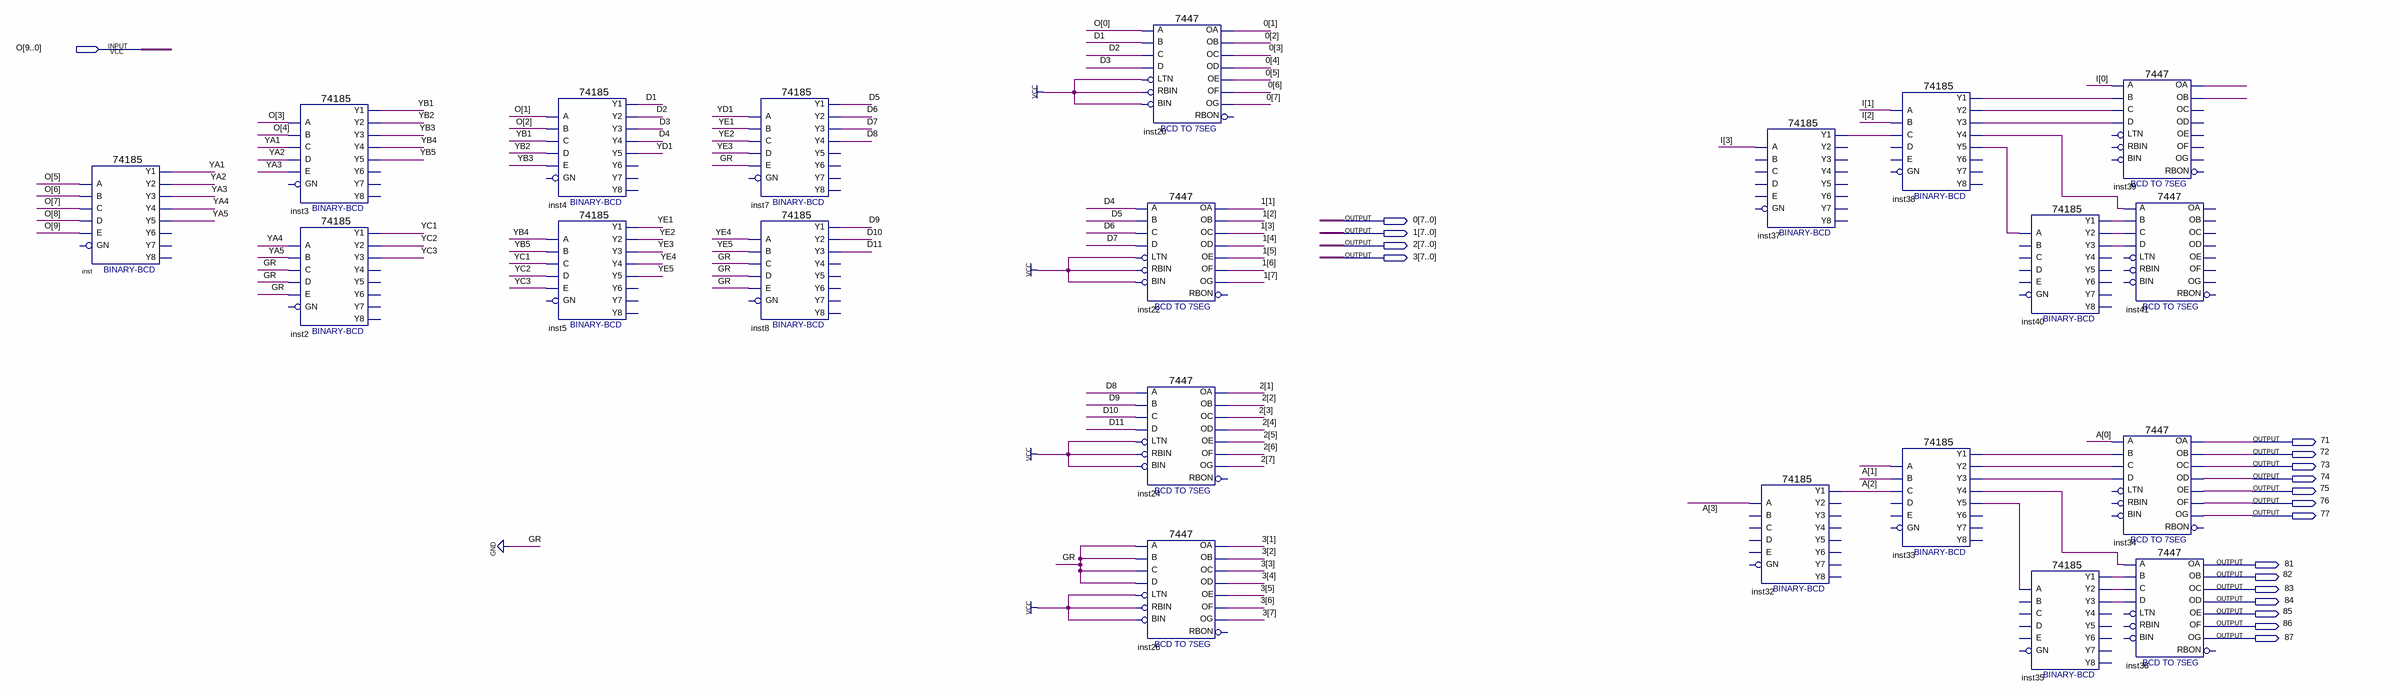
[diagram p0: schematic sheet]
// Quartus schematic hex0to3.bdf as structural Verilog: 21 symbols, 19 pins
module hex0to3 (
  input  [9:0] O,
  output [7:0] \0 ,
  output [7:0] \1 ,
  output [7:0] \2 ,
  output [7:0] \3 ,
  output \71 ,
  output \72 ,
  output \73 ,
  output \74 ,
  output \75 ,
  output \76 ,
  output \77 ,
  output \81 ,
  output \82 ,
  output \83 ,
  output \84 ,
  output \85 ,
  output \86 ,
  output \87 
);

  wire D1, D2, D3, D4, D5, D6, D7, D8, D9, D10, D11, inst32_y1, inst33_y1, inst33_y2, inst33_y3, inst33_y4,
       inst33_y5, inst35_y1, inst35_y2, inst35_y3, inst37_y1, inst38_y1, inst38_y2, inst38_y3, inst38_y4,
       inst38_y5, inst39_oa, inst39_ob, inst40_y1, inst40_y2, inst40_y3, YA1, YA2, YA3, YA4, YA5, YB1, YB2,
       YB3, YB4, YB5, YC1, YC2, YC3, YD1, YE1, YE2, YE3, YE4, YE5;
  wire [3:0] A, I;

  \74185  inst (
    .A(O[5]), .B(O[6]), .D(O[8]), .C(O[7]), .E(O[9]), .Y1(YA1), .Y3(YA3), .Y2(YA2), .Y5(YA5), .Y4(YA4));  // open: GN, Y6, Y8, Y7
  \74185  inst3 (
    .A(O[3]), .B(O[4]), .D(YA2), .C(YA1), .E(YA3), .Y1(YB1), .Y3(YB3), .Y2(YB2), .Y5(YB5), .Y4(YB4));  // open: GN, Y6, Y8, Y7
  \74185  inst2 (
    .A(YA4), .B(YA5), .D(1'b0), .C(1'b0), .E(1'b0), .Y1(YC1), .Y3(YC3), .Y2(YC2));  // open: GN, Y5, Y4, Y6, Y8, Y7
  \74185  inst4 (
    .A(O[1]), .B(O[2]), .D(YB2), .C(YB1), .E(YB3), .Y1(D1), .Y3(D3), .Y2(D2), .Y5(YD1), .Y4(D4));  // open: GN, Y6, Y8, Y7
  \74185  inst5 (
    .A(YB4), .B(YB5), .D(YC2), .C(YC1), .E(YC3), .Y1(YE1), .Y3(YE3), .Y2(YE2), .Y5(YE5), .Y4(YE4));  // open: GN, Y6, Y8, Y7
  \74185  inst7 (
    .A(YD1), .B(YE1), .D(YE3), .C(YE2), .E(1'b0), .Y1(D5), .Y3(D7), .Y2(D6), .Y4(D8));  // open: GN, Y5, Y6, Y8, Y7
  \74185  inst8 (
    .A(YE4), .B(YE5), .D(1'b0), .C(1'b0), .E(1'b0), .Y1(D9), .Y3(D11), .Y2(D10));  // open: GN, Y5, Y4, Y6, Y8, Y7
  \7447  inst20 (
    .LTN(1'b1), .B(D1), .C(D2), .D(D3), .RBIN(1'b1), .BIN(1'b1), .A(O[0]), .OB(\0 [2]), .OC(\0 [3]),
    .OE(\0 [5]), .OD(\0 [4]), .OF(\0 [6]), .OG(\0 [7]), .OA(\0 [1]));  // open: RBON
  \7447  inst22 (
    .LTN(1'b1), .B(D5), .C(D6), .D(D7), .RBIN(1'b1), .BIN(1'b1), .A(D4), .OB(\1 [2]), .OC(\1 [3]),
    .OE(\1 [5]), .OD(\1 [4]), .OF(\1 [6]), .OG(\1 [7]), .OA(\1 [1]));  // open: RBON
  \7447  inst24 (
    .LTN(1'b1), .B(D9), .C(D10), .D(D11), .RBIN(1'b1), .BIN(1'b1), .A(D8), .OB(\2 [2]), .OC(\2 [3]),
    .OE(\2 [5]), .OD(\2 [4]), .OF(\2 [6]), .OG(\2 [7]), .OA(\2 [1]));  // open: RBON
  \7447  inst26 (
    .LTN(1'b1), .B(1'b0), .C(1'b0), .D(1'b0), .RBIN(1'b1), .BIN(1'b1), .A(1'b0), .OB(\3 [2]), .OC(\3 [3]),
    .OE(\3 [5]), .OD(\3 [4]), .OF(\3 [6]), .OG(\3 [7]), .OA(\3 [1]));  // open: RBON
  \74185  inst37 (.A(I[3]), .Y1(inst37_y1));  // open: B, D, C, E, GN, Y3, Y2, Y5, Y4, Y6, Y8, Y7
  \74185  inst32 (.A(A[3]), .Y1(inst32_y1));  // open: B, D, C, E, GN, Y3, Y2, Y5, Y4, Y6, Y8, Y7
  \74185  inst38 (
    .A(I[1]), .B(I[2]), .C(inst37_y1), .Y1(inst38_y1), .Y3(inst38_y3), .Y2(inst38_y2), .Y5(inst38_y5),
    .Y4(inst38_y4));  // open: D, E, GN, Y6, Y8, Y7
  \74185  inst33 (
    .A(A[1]), .B(A[2]), .C(inst32_y1), .Y1(inst33_y1), .Y3(inst33_y3), .Y2(inst33_y2), .Y5(inst33_y5),
    .Y4(inst33_y4));  // open: D, E, GN, Y6, Y8, Y7
  \74185  inst40 (
    .A(inst38_y5), .Y1(inst40_y1), .Y3(inst40_y3), .Y2(inst40_y2));  // open: B, D, C, E, GN, Y5, Y4, Y6, Y8, Y7
  \74185  inst35 (
    .A(inst33_y5), .Y1(inst35_y1), .Y3(inst35_y3), .Y2(inst35_y2));  // open: B, D, C, E, GN, Y5, Y4, Y6, Y8, Y7
  \7447  inst39 (
    .B(inst38_y1), .C(inst38_y2), .D(inst38_y3), .A(I[0]), .OB(inst39_ob), .OA(inst39_oa));  // open: LTN, RBIN, BIN, OC, OE, OD, OF, OG, RBON
  \7447  inst41 (
    .B(inst40_y1), .C(inst40_y2), .D(inst40_y3), .A(inst38_y4));  // open: LTN, RBIN, BIN, OB, OC, OE, OD, OF, OG, OA, RBON
  \7447  inst34 (
    .B(inst33_y1), .C(inst33_y2), .D(inst33_y3), .A(A[0]), .OB(\72 ), .OC(\73 ), .OE(\75 ), .OD(\74 ),
    .OF(\76 ), .OG(\77 ), .OA(\71 ));  // open: LTN, RBIN, BIN, RBON
  \7447  inst36 (
    .B(inst35_y1), .C(inst35_y2), .D(inst35_y3), .A(inst33_y4), .OB(\82 ), .OC(\83 ), .OE(\85 ), .OD(\84 ),
    .OF(\86 ), .OG(\87 ), .OA(\81 ));  // open: LTN, RBIN, BIN, RBON
endmodule
